# Altium schematic sheet Power_Sheet.SchDoc
size A; SheetNumber: 2; SheetTotal: 6
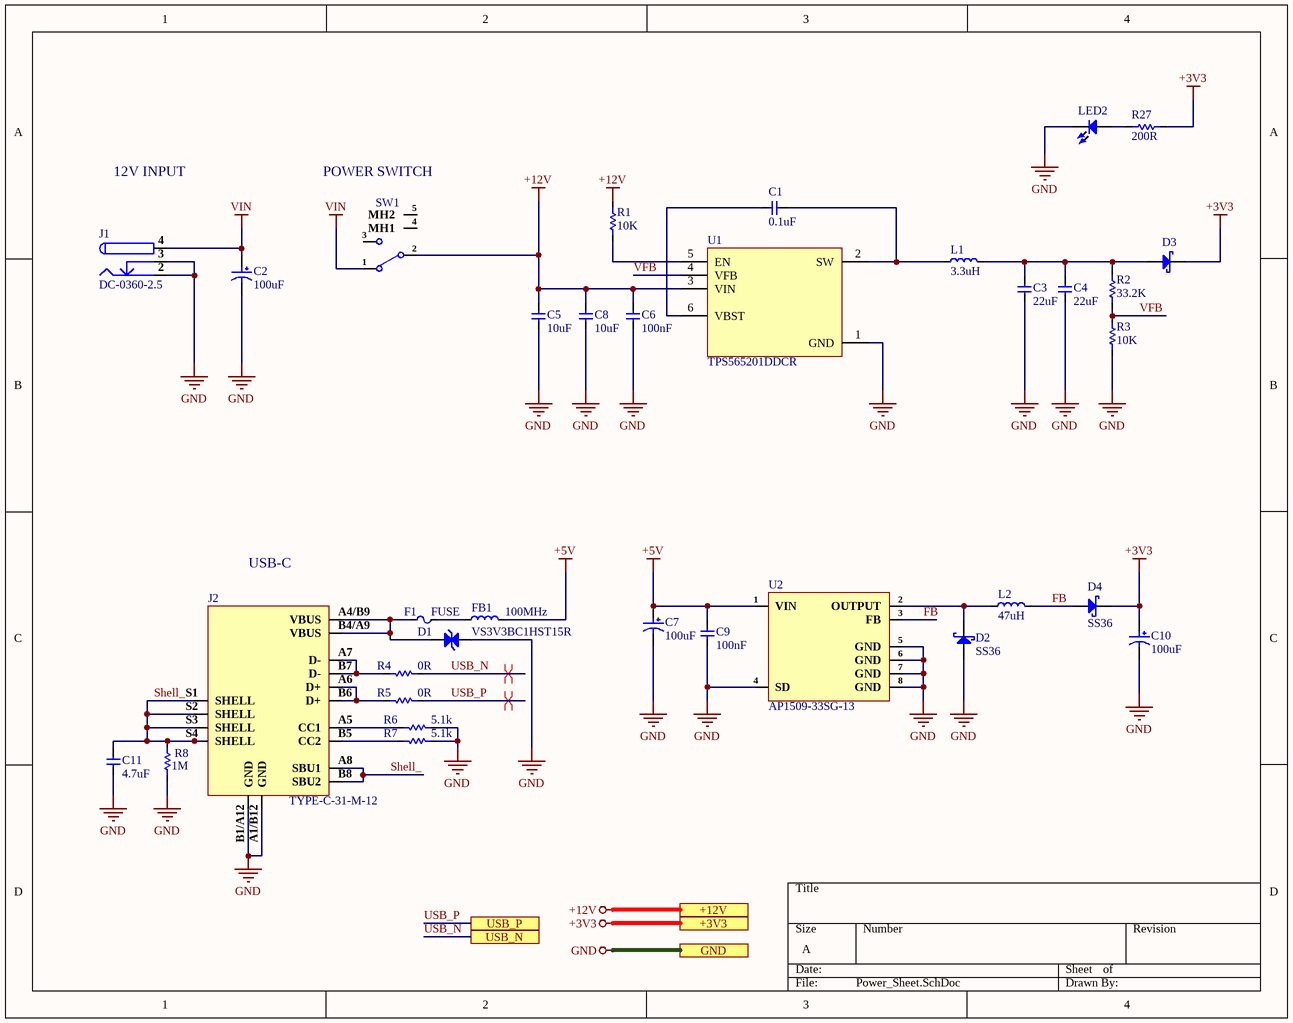
[diagram p0: Power_Sheet.SchDoc]

## Parts
C1  0.1uF  [Cap-0603]
C2  100uF  [RVT1H101M0607]
C3  22uF  [Cap-0402]
C4  22uF  [Cap-0402]
C5  10uF  [Cap-0603]
C6  100nF  [cap-0402]
C7  100uF  [RVT1H101M0607]
C8  10uF  [Cap-0603]
C9  100nF  [cap-0402]
C10  100uF  [RVT1H101M0607]
C11  4.7uF  [Cap-0603]
D1  VS3V3BC1HST15R  [VS3V3BC1HST15R]
D2  SS36  [SMA]
D3  (no value)  [SMB_]
D4  SS36  [SMA]
F1  FUSE  [Fuse 1206 (3216 Metric)]
FB1  100MHz  [IND-1206]
J1  DC-0360-2.5  [DC-0360-2.5]
J2  TYPE-C-31-M-12  [TYPE-C-31-M-12_]
L1  3.3uH  [FXL0530-3R3-M]
L2  47uH  [SMMS0650-470M]
LED2  (no value)  [LED-0603]
R1  10K  [Res-0603]
R2  33.2K  [Res-0603]
R3  10K  [Res-0603]
R4  0R  [Res-0402]
R5  0R  [Res-0402]
R6  5.1k  [Res-0201]
R7  5.1k  [Res-0201]
R8  1M  [Res-0402]
R27  200R  [Res-0402]
SW1  (no value)  [SS-12D11L5]
U1  TPS565201DDCR  [TPS565201DDCR]
U2  AP1509-33SG-13  [SOP-8L]

## Ports
+3V3 (see Top_Sheet[1C], Amplifier_Sheet[3D], Controller_Sheet[3D], LCD_Sheet[3D], Sensor_Sheet[3D]), +12V (see Top_Sheet[1C], Amplifier_Sheet[3D], Sensor_Sheet[3D]), GND (see Top_Sheet[1C], Amplifier_Sheet[3D], Controller_Sheet[3D], LCD_Sheet[3D], Sensor_Sheet[3D]), USB_N (see Top_Sheet[2C], Controller_Sheet[1D]), USB_P (see Top_Sheet[2C], Controller_Sheet[1D])

## Nets
+3V3: C10.1 D3.2(K) D4.1(K) R27.2 ; port +3V3
+5V: C7.1 C9.2 FB1.2 U2.1(VIN)
+12V: C5.2 C6.2 C8.2 R1.2 SW1.2 U1.3(VIN) ; port +12V
GND: C2.2 C3.1 C4.1 C5.1 C6.1 C7.2 C8.1 C9.1 C10.2 C11.1 D1.2(A) D2.2(A) J1.2 J1.3 J2.A1/B12(GND) J2.B1/A12(GND) LED2.2 R3.1 R6.1 R7.1 R8.1 U1.1(GND) U2.4(SD) U2.5(GND) U2.6(GND) U2.7(GND) U2.8(GND) ; port GND
VIN: C2.1 J1.4 SW1.1
FB: D4.2(A) L2.2 U2.3(FB)
Shell_: C11.2 J2.A8(SBU1) J2.B8(SBU2) J2.S1(SHELL) J2.S2(SHELL) J2.S3(SHELL) J2.S4(SHELL) R8.2
USB_N: R4.2 ; port USB_N
USB_P: R5.2 ; port USB_P
VFB: R2.1 R3.2 U1.4(VFB)
NetC1_1: C1.1 U1.6(VBST)
NetC1_2: C1.2 L1.1 U1.2(SW)
NetC3_2: C3.2 C4.2 D3.1(A) L1.2 R2.2
NetD1_1: D1.1(A) F1.1 J2.A4/B9(VBUS) J2.B4/A9(VBUS)
NetD2_1: D2.1(K) L2.1 U2.2(OUTPUT)
NetF1_2: F1.2 FB1.1
NetJ2_A5: J2.A5(CC1) R6.2
NetJ2_A6: J2.A6(D+) J2.B6(D+) R5.1
NetJ2_A7: J2.A7(D-) J2.B7(D-) R4.1
NetJ2_B5: J2.B5(CC2) R7.2
NetLED2_1: LED2.1 R27.1
NetR1_1: R1.1 U1.5(EN)

Not connected (* = marked no-connect by the designer): SW1 3 4(MH1) 5(MH2)

## Layout directives
differential pair; net class RS485; differential pair class RS485_LINES; rule Impedance Constraint [Min = 115.0    Max = 120.0    ]; rule Matched Net Lengths [Tolerance = 0.508mm]: USB_N, USB_P

## Notes on the sheet
- 12V INPUT
- (near SW1) POWER SWITCH
- (near J2) USB-C

## Library data of the parts
C1 = CC0603KRX7R0BB104: CAP CER 0.1UF 100V X7R 0603; Manufacturer: Yageo; Capacitance: 100nF; Tolerance: 10%; Item Type: Capacitor; Supplier 1: Digi-Key; Manufacturer Part Number: CC0603KRX7R0BB104; RoHS: Yes; Category: Ceramic Capacitors; Stock 1: 60476; Pricing 1: 1=0.19000, 10=0.13500, 50=0.07680, 100=0.06370, 500=0.04466, 1000=0.03696 (USD); Mount: Surface Mount; Case/Package: 0603; Case Code (Metric): 1608; Case Code (Imperial): 0603; Weight: 7.1E-05oz; Min Operating Temperature: -55°C; Max Operating Temperature: 125°C; Package Quantity: 4000; Voltage Rating: 100V; Packaging: Tape and Reel; Dielectric: X7R; Termination: SMD/SMT; Resistor Type: Ceramic; Voltage Rating (DC): 100V; Series: CC; Length: 0.063inch; Width: 0.031inch; Thickness: 0.035inch; Depth: 0.8mm; Lead Free: Lead Free; RoHS Compliant: Yes; ComponentLink1URL: https://datasheet.ciiva.com/6277/mlccorderingcode-6277030.pdf?src-supplier=Digi-Key; ComponentLink1Description: https://datasheet.ciiva.com/6277/mlccorderingcode-6277030.pdf?src-supplier=Digi-Key; ComponentLink2URL: https://datasheet.ciiva.com/6277/mlccorderingcode-6277081.pdf?src-supplier=Digi-Key; ComponentLink2Description: https://datasheet.ciiva.com/6277/mlccorderingcode-6277081.pdf?src-supplier=Digi-Key; ComponentLink3URL: https://datasheet.ciiva.com/6277/mlccorderingcode-6277082.pdf?src-supplier=Digi-Key; ComponentLink3Description: https://datasheet.ciiva.com/6277/mlccorderingcode-6277082.pdf?src-supplier=Digi-Key; Supplier Part Number 1: 311-1523-1-ND; LCSC Part Number: C113803
C2 C7 C10 = RVT1H101M0607: 100uF 50V ±20% SMD,D6.3xL7.7mm Aluminum Electrolytic Capacitors - SMD ROHS; Manufacturer: ROQANG; Manufacturer Part Number: RVT1H101M0607; Package: SMD,D6.3xL7.7mm; LCSC Part Number: C3151829; Item Type: Capacitor; ComponentLink1Description: LCSC; ComponentLink1URL: https://www.lcsc.com/product-detail/Aluminum-Electrolytic-Capacitors-SMD_ROQANG-RVT1H101M0607_C3151829.html
C3 C4 = GRM158R61A226ME15D: CAP CER 22UF 10V X5R 0402; Manufacturer: Murata; Material: 4241ConductorMaterial; Dielectric: 1537DielectricType; Tolerance: 20%; Item Type: Capacitor; Supplier: Mouser; Supplier Part Number: 81-GRM158R61A226ME5D; Manufacturer Part Number: GRM158R61A226ME15D; RoHS: Yes; Category: Ceramic Capacitors; Stock: 328944; Pricing: 1=0.46, 10=0.225, 50=0.225, 100=0.146, 1000=0.124, 10000=0.106 (USD); Case/Package: 343Case; Min Operating Temperature: -55°C; Max Operating Temperature: 85°C; Value: 22uF; Voltage Rating: 10V; Voltage Rating (DC): 10V; Length: 1mm; Width: 500um; Height: 800um; Thickness: 800um; LCSC Part Number: C3845593
C5 C8 = GRM188R6YA106MA73D: 10uF 35V X5R 20% Pad SMD 0603; Manufacturer: Murata; Supplier 1: Arrow Electronics; Manufacturer Part Number: GRM188R6YA106MA73D; RoHS: Yes; Category: Ceramic Capacitors; Stock 1: 37601; Pricing 1: 1=0.36650, 10=0.23380, 25=0.23160, 100=0.15050, 250=0.14890, 500=0.10700, 1000=0.09270, 3000=0.08640, 6000=0.07720, 15000=0.07140, 30000=0.05840 (USD); Mount: Surface Mount; Case/Package: 0603; Case Code (Metric): 1608; Case Code (Imperial): 0603; Min Operating Temperature: -55°C; Max Operating Temperature: 85°C; Packaging: Tape and Reel; Capacitance: 10uF; Voltage Rating: 35V; Tolerance: 20%; Voltage Rating (DC): 35V; Dielectric: X5R; Length: 0.063inch; Width: 0.031inch; Thickness: 0.039inch; RoHS Compliant: Yes; ComponentLink1URL: http://search.murata.co.jp/Ceramy/image/img/A01X/G101/ENG/GRM188R6YA106MA73-01.pdf?src-supplier=Future+Electronics; ComponentLink1Description: http://search.murata.co.jp/Ceramy/image/img/A01X/G101/ENG/GRM188R6YA106MA73-01.pdf?src-supplier=Future+Electronics; ComponentLink2URL: http://search.murata.co.jp/Ceramy/image/img/A01X/G101/ENG/GRM188R6YA106MA73-01.pdf?src-supplier=Digi-Key; ComponentLink2Description: http://search.murata.co.jp/Ceramy/image/img/A01X/G101/ENG/GRM188R6YA106MA73-01.pdf?src-supplier=Digi-Key; ComponentLink3URL: https://www.murata.com/~/media/webrenewal/support/library/catalog/products/capacitor/mlcc/c02e.ashx?la=en-us&src-supplier=Digi-Key; ComponentLink3Description: https://www.murata.com/~/media/webrenewal/support/library/catalog/products/capacitor/mlcc/c02e.ashx?la=en-us&src-supplier=Digi-Key; ComponentLink4URL: http://search.murata.co.jp/Ceramy/image/img/A01X/G101/ENG/GRM188R6YA106MA73-01.pdf?src-supplier=Mouser; ComponentLink4Description: http://search.murata.co.jp/Ceramy/image/img/A01X/G101/ENG/GRM188R6YA106MA73-01.pdf?src-supplier=Mouser; ComponentLink5URL: http://search.murata.co.jp/Ceramy/image/img/A01X/G101/ENG/GRM188R6YA106MA73-01.pdf?src-supplier=TTI; ComponentLink5Description: http://search.murata.co.jp/Ceramy/image/img/A01X/G101/ENG/GRM188R6YA106MA73-01.pdf?src-supplier=TTI; Supplier Part Number 1: GRM188R6YA106MA73D; LCSC Part Number: C194427
C6 C9 = C1005X7R1H104KT000F: CAP CER 0.1UF 50V X7R 0402; Manufacturer: TDK; Tolerance: 10%; Voltage: 25V; Item Type: Capacitor; Supplier 1: Avnet; Manufacturer Part Number: C1005X7R1H104KT000F; RoHS: No; Category: Ceramic Capacitors; Dielectric: X7R; Supplier Part Number 1: C1005X7R1H104KT000F; LCSC Part Number: C361198; ComponentLink1Description: LCSC; ComponentLink1URL: https://www.lcsc.com/product-detail/Multilayer-Ceramic-Capacitors-MLCC-SMD-SMT_TDK-C1005X7R1H104KT000F_C361198.html
C11 = CC0603KRX7R9BB472: 50V 4.7nF X7R ±10% 0603 Multilayer Ceramic Capacitors MLCC - SMD/SMT ROHS; Manufacturer: YAGEO; Manufacturer Part Number: CC0603KRX7R9BB472; LCSC Part Number: C106218; Item Type: Capacitor; Package: 0603; ComponentLink1Description: LCSC Link; ComponentLink1URL: https://www.lcsc.com/product-detail/Multilayer-Ceramic-Capacitors-MLCC-SMD-SMT_YAGEO-CC0603KRX7R9BB472_C106218.html
D1 = VS3V3BC1HST15R: 8.5V 70W 4V 3.3V SOD-962 Electrostatic and Surge Protection (TVS/ESD) ROHS; Manufacturer: Rohm Semiconductor; Item Type: TVS; Manufacturer Part Number: VS3V3BC1HST15R; LCSC Part Number: VS3V3BC1HST15R; Package: SOD-962; ComponentLink1Description: LCSC Link; ComponentLink1URL: https://www.lcsc.com/product-detail/Electrostatic-and-Surge-Protection-TVS-ESD_ROHM-Semicon-VS3V3BC1HST15R_C509714.html
D2 D4 = SS36: Schottky Barrier Diode SK36, DO-214AB, 3A/60V; Manufacturer: ON Semiconductor / Fairchild; Output Current: 3A; Element Configuration: Single; Forward Voltage: 750mV; Max Repetitive Reverse Voltage (Vrrm): 60V; Max Forward Surge Current (Ifsm): 100A; Max Reverse Current: 500uA; Polarity: Standard; Power Dissipation: 2.27W; Supplier 1: Rs; Manufacturer Part Number: SS36; RoHS: Yes; Category: Schottky Diodes; Stock 1: 100; Pricing 1: 100=0.43800, 500=0.34200, 1000=0.27800, 3000=0.25000 (GBP); Mount: Surface Mount; Case/Package: SMC; Number of Pins: 2; Min Operating Temperature: -55°C; Max Operating Temperature: 150°C; Packaging: Tape and Reel; Package Quantity: 3000; Series: -; Forward Current: 3A; Peak Non-Repetitive Surge Current: 100A; Voltage Rating (DC): 60V; Current Rating: 3A; Max Surge Current: 100A; Average Rectified Current: 3A; Max Reverse Leakage Current: 500uA; Max Reverse Voltage (DC): 60V; Current: 3A; Voltage: 60V; Radiation Hardening: No; RoHS Compliant: Yes; Reach SVHC Compliant: Yes; Lead Free: Lead Free; ComponentLink1URL: https://datasheet.ciiva.com/4714/ss36-197193-4714610.pdf?src-supplier=Mouser; ComponentLink1Description: https://datasheet.ciiva.com/4714/ss36-197193-4714610.pdf?src-supplier=Mouser; ComponentLink2URL: https://datasheet.ciiva.com/16889/ss36-16889545.pdf?src-supplier=Future+Electronics; ComponentLink2Description: https://datasheet.ciiva.com/16889/ss36-16889545.pdf?src-supplier=Future+Electronics; ComponentLink3URL: https://datasheet.ciiva.com/920/ss34-920433.pdf?src-supplier=Digi-Key; ComponentLink3Description: https://datasheet.ciiva.com/920/ss34-920433.pdf?src-supplier=Digi-Key; ComponentLink4URL: https://datasheet.ciiva.com/920/ss34-920434.pdf?src-supplier=Digi-Key; ComponentLink4Description: https://datasheet.ciiva.com/920/ss34-920434.pdf?src-supplier=Digi-Key; ComponentLink5URL: https://datasheet.ciiva.com/920/ss34-920435.pdf?src-supplier=Digi-Key; ComponentLink5Description: https://datasheet.ciiva.com/920/ss34-920435.pdf?src-supplier=Digi-Key; Supplier Part Number 1: 9034425P; LCSC Part Number: C16015; Item Type: Diode
D3 = SS54B-HF: DIODE SCHOTTKY 5A 40V SMB; Manufacturer: Comchip; Supplier 1: Mouser; Manufacturer Part Number: SS54B-HF; RoHS: No; Stock 1: 2862; Pricing 1: 1=0.56000, 10=0.32900, 50=0.32900, 100=0.17100, 1000=0.11900, 10000=0.09000 (USD); Supplier Part Number 1: 750-SS54B-HF; LCSC Part Number: C3759253
F1 = 1206L300SL12AR: 12V 3A 50A 6A 1206 Resettable Fuses ROHS; Manufacturer: LUTE; Manufacturer Part Number: Manufacturer; ComponentLink1Description: LCSC Link; ComponentLink1URL: https://www.lcsc.com/product-detail/Resettable-Fuses_LUTE-1206L300SL12AR_C18198361.html; LCSC Part Number: C18198361; Item Type: FUSE; Package: 1206
FB1 = BLM31PG121SN1L: FERRITE BEAD 120 OHM 1206 1LN; Manufacturer: Murata; Material: Steel,Ferrite; Tolerance: 25%; Impedance: 120R; Max Current Rating: 3.5A; Number of Lines: 1; DC Resistance (DCR): 20mR; Max DC Current: 3A; Shielding: Unshielded; Supplier 1: Avnet; Manufacturer Part Number: BLM31PG121SN1L; RoHS: Yes; Category: Ferrite Beads and Chips; Stock 1: 290640; Pricing 1: 3000=0.11563, 6000=0.10938, 12000=0.10313, 18000=0.09688, 24000=0.09063, 30000=0.08438, 300000=0.07813 (USD); Case/Package: 1206; Number of Pins: 2; Core Material: Ferrite; Case Code (Metric): 3216; Case Code (Imperial): 1206; Contact Plating: Tin,Matte; Min Operating Temperature: -55°C; Max Operating Temperature: 125°C; Package Quantity: 3000; Packaging: Tape and Reel; Current Rating: 3.5A; Termination: SMD/SMT; Test Frequency: 100MHz; DC Current: 3A; Frequency: 100MHz; Length: 3.2mm; Width: 1.6mm; Height: 1.1mm; Depth: 1.6mm; Radiation Hardening: No; Military Standard: Not; Lead Free: Lead Free; RoHS Compliant: Yes; ComponentLink1URL: https://datasheet.ciiva.com/19460/1845419-19460234.pdf?src-supplier=Jameco; ComponentLink1Description: https://datasheet.ciiva.com/19460/1845419-19460234.pdf?src-supplier=Jameco; ComponentLink2URL: https://datasheet.ciiva.com/1012/l0132s0193blm31p-1012992.pdf?src-supplier=Digi-Key; ComponentLink2Description: https://datasheet.ciiva.com/1012/l0132s0193blm31p-1012992.pdf?src-supplier=Digi-Key; ComponentLink3URL: https://datasheet.ciiva.com/11799/0900766b811b5866-11799444.pdf?src-supplier=RSComponents; ComponentLink3Description: https://datasheet.ciiva.com/11799/0900766b811b5866-11799444.pdf?src-supplier=RSComponents; ComponentLink4URL: https://datasheet.ciiva.com/3081/l0110s0100blm31p-3081665.pdf?src-supplier=Avnet; ComponentLink4Description: https://datasheet.ciiva.com/3081/l0110s0100blm31p-3081665.pdf?src-supplier=Avnet; ComponentLink5URL: https://datasheet.ciiva.com/41449/001172383-da-01-en-drossel-1206-120r-3-2x1-60mm-3000st-41449554.pdf?src-supplier=Conrad; ComponentLink5Description: https://datasheet.ciiva.com/41449/001172383-da-01-en-drossel-1206-120r-3-2x1-60mm-3000st-41449554.pdf?src-supplier=Conrad; ComponentLink6URL: https://datasheet.ciiva.com/29348/442557-da-01-en-chip-drossel-1206-120r-3000ma-3-2x1-60mm-29348014.pdf?src-supplier=Conrad; ComponentLink6Description: https://datasheet.ciiva.com/29348/442557-da-01-en-chip-drossel-1206-120r-3000ma-3-2x1-60mm-29348014.pdf?src-supplier=Conrad; ComponentLink7URL: https://datasheet.ciiva.com/14122/apblm31p-data-e-14122856.pdf?src-supplier=Distrelec; ComponentLink7Description: https://datasheet.ciiva.com/14122/apblm31p-data-e-14122856.pdf?src-supplier=Distrelec; ComponentLink8URL: https://datasheet.ciiva.com/48436/blm31pg121sn1l-eng-tds-48436731.pdf?src-supplier=Distrelec; ComponentLink8Description: https://datasheet.ciiva.com/48436/blm31pg121sn1l-eng-tds-48436731.pdf?src-supplier=Distrelec; ComponentLink9URL: https://datasheet.ciiva.com/1012/l0110s0100blm31p-1012991.pdf?src-supplier=Digi-Key; ComponentLink9Description: https://datasheet.ciiva.com/1012/l0110s0100blm31p-1012991.pdf?src-supplier=Digi-Key; ComponentLink10URL: https://datasheet.ciiva.com/1012/l0110s0100blm31p-1012993.pdf?src-supplier=Digi-Key; ComponentLink10Description: https://datasheet.ciiva.com/1012/l0110s0100blm31p-1012993.pdf?src-supplier=Digi-Key; ComponentLink11URL: https://datasheet.ciiva.com/3081/l0110s0100blm31p-3081666.pdf?src-supplier=Avnet; ComponentLink11Description: https://datasheet.ciiva.com/3081/l0110s0100blm31p-3081666.pdf?src-supplier=Avnet; ComponentLink12URL: https://datasheet.ciiva.com/16390/l0110s0100blm31p-16390857.pdf?src-supplier=Future+Electronics; ComponentLink12Description: https://datasheet.ciiva.com/16390/l0110s0100blm31p-16390857.pdf?src-supplier=Future+Electronics; ComponentLink13URL: https://datasheet.ciiva.com/18093/getdatasheetpartid-152966-18093084.pdf?src-supplier=Verical; ComponentLink13Description: https://datasheet.ciiva.com/18093/getdatasheetpartid-152966-18093084.pdf?src-supplier=Verical; Supplier Part Number 1: BLM31PG121SN1L; LCSC Part Number: C85841; Item Type: Ferrite Bead
J1 = DC-0360-2.5: DC Power Receptacle 260℃ Brass -20℃~+70℃ 2.5mm 6mm 2.5A 24V Plugin AC/DC Power Connectors ROHS; Manufacturer: XKB Connectivity; Item Type: DC Jack; Manufacturer Part Number: DC-0360-2.5; Package: Plugin; LCSC Part Number: C319122; ComponentLink1Description: LCSC; ComponentLink1URL: https://www.lcsc.com/product-detail/AC-DC-Power-Connectors_XKB-Connectivity-DC-0360-2-5_C319122.html
J2 = TYPE-C-31-M-12: 250mA 1 16 Female Type-C SMD USB Connectors ROHS; Manufacturer: Korean Hroparts Elec; ComponentLink1Description: LCSC; ComponentLink1URL: https://www.lcsc.com/product-detail/USB-Connectors_Korean-Hroparts-Elec-TYPE-C-31-M-12_C165948.html; Manufacturer Part Number: TYPE-C-31-M-12; Footprint: Custom; LCSC Part Number: C165948; Item Type: USB Connector
L1 = FXL0530-3R3-M: 5.5A 3.3uH Molding Choke ±20% 6A SMD,5.2x5.4mm Power Inductors ROHS; Manufacturer: cjiang (Changjiang Microelectronics Tech); Manufacturer Part Number: FXL0530-3R3-M; LCSC Part Number: C475518; Item Type: inductor; Package: SMD,5.2x5.4mm; ComponentLink1Description: LCSC Link; ComponentLink1URL: https://www.lcsc.com/product-detail/Power-Inductors_cjiang-Changjiang-Microelectronics-Tech-FXL0530-3R3-M_C475518.html
L2 = SMMS0650-470M: 2A 47uH Molding Choke ±20% 2.8A SMD,6.6x7.1mm Power Inductors ROHS; Manufacturer: SXN(Shun Xiang Nuo Elec); Manufacturer Part Number: SMMS0650-470M; LCSC Part Number: C149588; Item Type: Inductor; Package: SMD,6.6x7.1mm; ComponentLink1Description: LCSC Link; ComponentLink1URL: https://www.lcsc.com/product-detail/Power-Inductors_SXN-Shun-Xiang-Nuo-Elec-SMMS0650-470M_C149588.html
LED2 = NCD0603B3: blue 0603 Light Emitting Diodes (LED) ROHS; Manufacturer: Foshan NationStar Optoelectronics; Manufacturer Part Number: NCD0603B3; Package: 0603; LCSC Part Number: C158101; Item Type: LED; ComponentLink1Description: LCSC; ComponentLink1URL: https://www.lcsc.com/product-detail/Light-Emitting-Diodes-LED_Foshan-NationStar-Optoelectronics-NCD0603B3_C158101.html
R1 R3 = RT0603BRD0710KL: RES SMD 10K OHM 0.1% 1/10W 0603; Manufacturer: Yageo; Power: 100mW; Rated Temperature: 70°C; Value: 10kR; Temperature Coefficient: 25ppm/°C; Working Voltage: 75V; Package Height: 0.45mm; Package Length: 1.6mm; Package Width: 0.8mm; Item Type: Resistor; Supplier 1: Rs; Manufacturer Part Number: RT0603BRD0710KL; RoHS: Yes; Category: Chip SMD Resistors; Stock 1: 20510; Pricing 1: 100=0.29800, 250=0.27800, 500=0.25900, 1000=0.23700 (GBP); Mounting Technology: Surface Mount; Pins: 2; Case/Package: 0603; Min Operating Temperature: -55°C; Max Operating Temperature: 155°C; Tolerance: 0.1%; Resistor Type: FIXED RESISTOR; Construction: Chip; Package Style: SMTMeter; Packaging: Tape and Reel; Technology: THIN FILM; Termination: Wraparound; Reach SVHC Compliant: Yes; RoHS Compliant: Yes; ComponentLink1URL: https://datasheet.ciiva.com:443/pdfs/VipMasterIC/IC/YAGO/YAGO-S-A0008510989/YAGO-S-A0008510989-1.pdf?src-supplier=IHS+Markit; ComponentLink1Description: https://datasheet.ciiva.com:443/pdfs/VipMasterIC/IC/YAGO/YAGO-S-A0008510989/YAGO-S-A0008510989-1.pdf?src-supplier=IHS+Markit; ComponentLink2URL: https://datasheet.ciiva.com/5624/pyu-rt-1-to-0-05-rohs-l-4-5624351.pdf?src-supplier=Mouser; ComponentLink2Description: https://datasheet.ciiva.com/5624/pyu-rt-1-to-0-05-rohs-l-4-5624351.pdf?src-supplier=Mouser; ComponentLink3URL: https://datasheet.ciiva.com/29721/pyu-rt-1-to-0-05-rohs-l-4-29721177.pdf?src-supplier=Digi-Key; ComponentLink3Description: https://datasheet.ciiva.com/29721/pyu-rt-1-to-0-05-rohs-l-4-29721177.pdf?src-supplier=Digi-Key; Supplier Part Number 1: 1991391P; LCSC Part Number: C95204
R2 = RC0603FR-0733K2L: RES 33.2K OHM 1% 1/10W 0603; Manufacturer: Yageo; Resistance: 33.2kR; Power Rating: 100mW; Voltage Rating: 50V; Temperature Coefficient: 100ppm/°C; Supplier 1: Digi-Key; Manufacturer Part Number: RC0603FR-0733K2L; RoHS: Yes; Category: Chip SMD Resistors; Stock 1: 1293262; Pricing 1: 1=0.10000, 10=0.02300, 100=0.00930, 1000=0.00417, 2500=0.00362 (USD); Mount: Surface Mount; Case/Package: 0603; Case Code (Imperial): 0603; Case Code (Metric): 1608; Size Code: 0603; Min Operating Temperature: -55°C; Max Operating Temperature: 155°C; Tolerance: 1%; Packaging: Tape and Reel; Termination: SMD/SMT; Resistor Type: Thick Film; Voltage Rating (DC): 50V; Features: Moisture Resistant; Series: RC; Max Power Dissipation: 100mW; Number of Terminations: 2; Construction: Rectangular; Technology: THICK FILM; Length: 1.6mm; Height: 0.45mm; Depth: 0.8mm; Military Standard: Not; Lead Free: Lead Free; RoHS Compliant: Yes; ComponentLink1URL: https://datasheet.ciiva.com/11808/0900766b80f96399-11808316.pdf?src-supplier=RSComponents; ComponentLink1Description: https://datasheet.ciiva.com/11808/0900766b80f96399-11808316.pdf?src-supplier=RSComponents; Supplier Part Number 1: 311-33.2KHRCT-ND; LCSC Part Number: C185338
R4 R5 = RC0402FR-070RL: RES 0 OHM JUMPER 1/16W 0402; Manufacturer: Yageo; Tolerance: 1%; Power Rating: 62.5mW; Voltage Rating: 50V; Temperature Coefficient: 200ppm/°C; Max Power Dissipation: 63mW; Supplier 1: Mouser; Manufacturer Part Number: RC0402FR-070RL; RoHS: Yes; Category: Chip SMD Resistors; Stock 1: 8556842; Pricing 1: 1=0.10000, 10=0.01400, 50=0.01400, 100=0.00600, 1000=0.00300, 5000=0.00200, 10000=0.00100 (USD); Mount: Surface Mount; Case/Package: 0402; Contact Plating: Tin,Matte; Case Code (Imperial): 0402; Case Code (Metric): 1005; Size Code: 0402; Min Operating Temperature: -55°C; Max Operating Temperature: 155°C; Resistance: 0R; Resistor Type: Thick Film; Packaging: Tape and Reel; Termination: SMD/SMT; Features: Moisture Resistant; Series: RC; Number of Terminations: 2; Length: 1mm; Width: 0.5mm; Height: 0.35mm; Radiation Hardening: No; Lead Free: Lead Free; RoHS Compliant: Yes; ComponentLink1URL: https://datasheet.ciiva.com/8896/pyu-rc0402-51-rohs-l-6-8896149.pdf?src-supplier=Avnet; ComponentLink1Description: https://datasheet.ciiva.com/8896/pyu-rc0402-51-rohs-l-6-8896149.pdf?src-supplier=Avnet; ComponentLink2URL: https://datasheet.ciiva.com/16790/pyu-rc0402-51-rohs-l-6-r-16790444.pdf?src-supplier=Future+Electronics; ComponentLink2Description: https://datasheet.ciiva.com/16790/pyu-rc0402-51-rohs-l-6-r-16790444.pdf?src-supplier=Future+Electronics; Supplier Part Number 1: 603-RC0402FR-070RL; LCSC Part Number: C106231
R6 R7 = RC0201FR-075K1L: RES 5.1K OHM 1% 1/20W 0201; Manufacturer: Yageo; Power Rating: 50mW; Value: 5.1kR; Voltage Rating: 25V; Temperature Coefficient: 200ppm/°C; Item Type: Resistor; Supplier: Future Electronics; Supplier Part Number: 9072847; Manufacturer Part Number: RC0201FR-075K1L; RoHS: Yes; Category: Chip SMD Resistors; Stock: 280000; Pricing: 10000=0.0014, 40000=0.0013, 200000=0.0013, 400000=0.0012, 1250000=0.0011 (USD); Case/Package: 0201; Case Code (Imperial): 0201; Case Code (Metric): 0603; Min Operating Temperature: -55°C; Max Operating Temperature: 125°C; Packaging: Tape and Reel; Tolerance: 1%; Termination: SMD/SMT; Number of Terminations: 2; Max Power Dissipation: 50mW; Features: Moisture Resistant; Series: RC; Length: 0.6mm; Width: 0.3mm; Height: 0.23mm; Lead Free: Lead Free; RoHS Compliant: Yes; ComponentLink1URL: http://www.mouser.com/ds/2/447/RC0201-559633.pdf?src-supplier=Mouser; ComponentLink1Description: http://www.mouser.com/ds/2/447/RC0201-559633.pdf?src-supplier=Mouser; ComponentLink2URL: https://datasheet.octopart.com/RC0201FR-075K1L-Yageo-datasheet-164759695.pdf?src-supplier=Future+Electronics; ComponentLink2Description: https://datasheet.octopart.com/RC0201FR-075K1L-Yageo-datasheet-164759695.pdf?src-supplier=Future+Electronics; ComponentLink3URL: http://www.yageo.com/documents/recent/PYu-RC_Group_51_RoHS_L_10.pdf?src-supplier=Digi-Key; ComponentLink3Description: http://www.yageo.com/documents/recent/PYu-RC_Group_51_RoHS_L_10.pdf?src-supplier=Digi-Key; LCSC Part Number: C274341
R8 = AF0402JR-071ML: RES SMD 1M OHM 5% 1/16W 0402; Manufacturer: Yageo; Resistance: 1MR; Max Power Dissipation: 63mW; Temperature Coefficient: 100ppm/°C; Item Type: Resistor; Supplier 1: Digi-Key; Manufacturer Part Number: AF0402JR-071ML; Stock 1: 0; Pricing 1: 10000=0.00408 (USD); Case/Package: 0402; Min Operating Temperature: -55°C; Max Operating Temperature: 155°C; Packaging: Tape and Reel; Resistor Type: Thick Film; Number of Terminations: 2; Tolerance: 5%; Features: Moisture Resistant,Anti-Sulfur; Length: 0.039inch; Width: 0.02inch; Height: 0.015inch; RoHS Compliant: Yes; ComponentLink1URL: https://www.yageo.com/upload/media/product/productsearch/datasheet/rchip/PYu-AF_51_RoHS_L_6.pdf?src-supplier=Digi-Key; ComponentLink1Description: https://www.yageo.com/upload/media/product/productsearch/datasheet/rchip/PYu-AF_51_RoHS_L_6.pdf?src-supplier=Digi-Key; Supplier Part Number 1: AF0402JR-071ML-ND; LCSC Part Number: C144054
R27 = FRC0402F2000TS: 62.5mW Thick Film Resistors 50V ±100ppm/℃ ±1% 200Ω 0402 Chip Resistor - Surface Mount ROHS; Manufacturer: FOJAN; Manufacturer Part Number: FRC0402F2000TS; LCSC Part Number: C2909333; Item Type: Resistor; Package: 0402; ComponentLink1Description: LCSC Link; ComponentLink1URL: https://www.lcsc.com/product-detail/Chip-Resistor-Surface-Mount_FOJAN-FRC0402F2000TS_C2909333.html
SW1 = SS-12D11L5: Lying 3A SPDT 125V 6.3mm 13.5mm 125V 6.6mm 3A PCPin 10000 Rectangular columnar -40℃~+85℃ Black Plugin Slide Switches ROHS; Manufacturer: XKB Connectivity; Item Type: Switch; Manufacturer Part Number: SS-12D11L5; Package: Plugin; LCSC Part Number: C319010; ComponentLink1Description: LCSC Part Number; ComponentLink1URL: https://www.lcsc.com/product-detail/Slide-Switches_XKB-Connectivity-SS-12D11L5_C319010.html
U1 = TPS565201DDCR: 4.5V to 17V, 5A, Synchronous Step-Down Voltage Regulator in SOT23 6-SOT-23-THIN -40 to 125; Manufacturer: Texas Instruments; Item Type: Buck; Availability: Warning; Texas_Instruments-Purchase-URL: https://snapeda.com/shop?store=Texas+Instruments&id=2751914; Package: SOT-23-THN-6 Texas Instruments; Manufacturer Part Number: TPS565201DDCR; DigiKey-Purchase-URL: https://snapeda.com/shop?store=DigiKey&id=2751914; SnapEDA_Link: https://www.snapeda.com/parts/TPS565201DDCR/Texas%20Instruments/view-part/2751914/?ref=snap; Mouser-Purchase-URL: https://snapeda.com/shop?store=Mouser&id=2751914; Value: *; Price: None; ComponentLink1Description: LCSC Link; ComponentLink1URL: https://www.lcsc.com/product-detail/DC-DC-Converters_Texas-Instruments-TPS565201DDCR_C327676.html; LCSC Part Number: C327676
U2 = AP1509-33SG-13: IC REG BUCK 3.3V 2A 8SOP; Manufacturer: Diodes; Supplier: Digi-Key; Supplier Part Number: AP1509-33SGDICT-ND; Manufacturer Part Number: AP1509-33SG-13; RoHS: Yes; Category: Voltage Regulators - Switching; Stock: 7160; Pricing: 1=1.6, 10=1.43, 25=1.3576, 100=1.115, 250=1.04232, 500=0.92112, 1000=0.7272 (USD); ComponentLink1URL: https://datasheet.ciiva.com/2024/ap1509-2024112.pdf?src-supplier=Digi-Key; ComponentLink1Description: https://datasheet.ciiva.com/2024/ap1509-2024112.pdf?src-supplier=Digi-Key; ComponentLink2URL: https://datasheet.ciiva.com/22696/608784-22696879.pdf?src-supplier=Element14; ComponentLink2Description: https://datasheet.ciiva.com/22696/608784-22696879.pdf?src-supplier=Element14; ComponentLink3URL: https://datasheet.ciiva.com/3220/ap1509-3220415.pdf?src-supplier=Avnet; ComponentLink3Description: https://datasheet.ciiva.com/3220/ap1509-3220415.pdf?src-supplier=Avnet; ComponentLink4URL: https://datasheet.ciiva.com/3222/ap1509-3222047.pdf?src-supplier=Avnet; ComponentLink4Description: https://datasheet.ciiva.com/3222/ap1509-3222047.pdf?src-supplier=Avnet; ComponentLink5URL: https://datasheet.ciiva.com/1161/608784-1161659.pdf?src-supplier=Element14; ComponentLink5Description: https://datasheet.ciiva.com/1161/608784-1161659.pdf?src-supplier=Element14; LCSC Part Number: C151823; Item Type: IC